# Altium schematic sheet gsm.SchDoc
size B; SheetNumber: 5; SheetTotal: 6
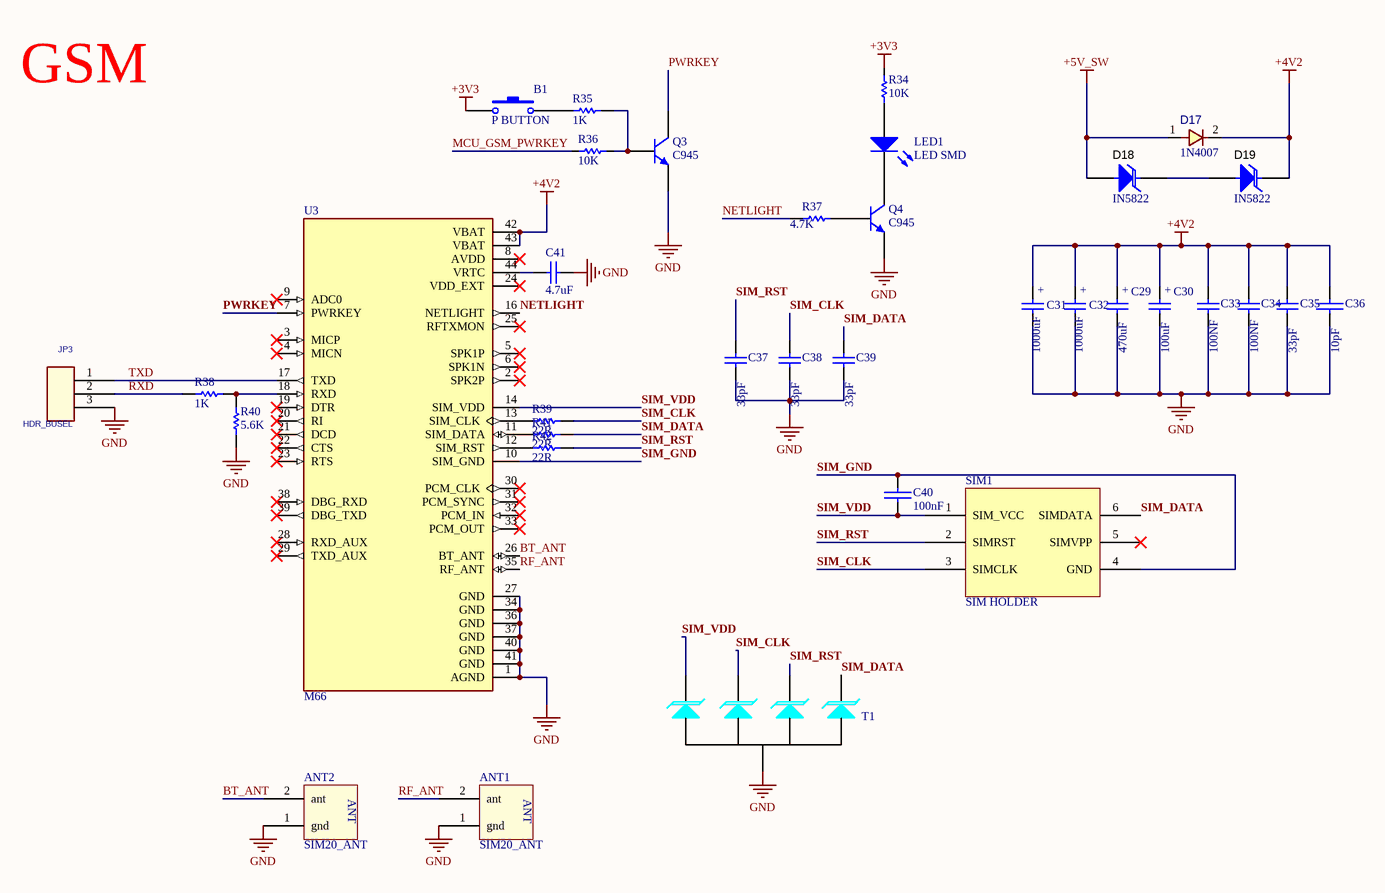
[diagram p0: gsm.SchDoc]

## Parts
ANT1  SIM20_ANT  [MY_SIM20_ANT]
ANT2  SIM20_ANT  [MY_SIM20_ANT]
B1  P BUTTON  [MY_SPST-0.5]
C29  470uF  [MY_Cap1000u -smd]
C30  100uF  [MY_Cap1000u -smd]
C31  1000uF  [MY_CAP_SMD-C]
C32  1000uF  [MY_CAP_SMD-C]
C33  100NF  [CAP0603]
C34  100NF  [CAP0603]
C35  33pF  [CAP0603]
C36  10pF  [Cap-0603]
C37  33pF  [CAP0603]
C38  33pF  [CAP0603]
C39  33pF  [CAP0603]
C40  100nF  [Cap-0805]
C41  4.7uF  [CAPC3413X12N]
D17  value 1N4007  [D_SMA]  (hidden comment: 1N4007 SMD M7)
D18  value IN5822  [BYW98]  (hidden comment: IN5822 THD)
D19  value IN5822  [BYW98]  (hidden comment: IN5822 THD)
JP3  HDR_BUSEL  [HDR_1x3]
LED1  LED SMD  [MY_LED_SMD]
Q3  C945  [SOT23_N]
Q4  C945  [SOT23_N]
R34  10K  [RES 0603 (1608X06L)]
R35  1K  [Resistor_SMD_1206 (3216)]
R36  10K  [RES 0603 (1608X06L)]
R37  4.7K  [Resistor_SMD_1206]
R38  1K  [Resistor_SMD_1206 (3216)]
R39  22R  [Resistor_SMD_0603 (1608)]
R40  5.6K  [Resistor_SMD_0805 (2012)]
R41  22R  [Resistor_SMD_0603 (1608)]
R42  22R  [Resistor_SMD_0603 (1608)]
SIM1  SIM HOLDER  [SIM HOLDER 6]
T1  TVS (SMF05)  [SC70-5L]  (value not drawn)
U3  M66  [XCVR_M66]

## Nets
+3V3: B1.1 R34.2
+4V2: C29.+ C30.+ C31.+ C32.+ C33.2 C34.2 C35.2 C36.1 D17.2 D19.2(K) U3.42(VBAT) U3.43(VBAT)
+5V_SW: D17.1 D18.1(A)
GND: ANT1.1(gnd) ANT2.1(gnd) C29.- C30.- C31.- C32.- C33.1 C34.1 C35.1 C36.2 C37.1 C38.1 C39.1 C41.2 JP3.3 Q3.2(E) Q4.2(E) R40.1 T1.2(A) U3.1(AGND) U3.27(GND) U3.34(GND) U3.36(GND) U3.37(GND) U3.40(GND) U3.41(GND)
BT_ANT: ANT2.2(ant) U3.26(BT_ANT)
MCU_GSM_PWRKEY: R36.1
NETLIGHT: R37.1 U3.16(NETLIGHT)
PWRKEY: Q3.3(C) U3.7(PWRKEY)
RF_ANT: ANT1.2(ant) U3.35(RF_ANT)
RXD: JP3.2 R38.1
SIM_CLK: C38.2 R39.2 SIM1.3(SIMCLK) T1.3(K)
SIM_DATA: C39.2 R41.2 SIM1.6(SIMDATA) T1.5(K)
SIM_GND: C40.1 SIM1.4(GND) U3.10(SIM_GND)
SIM_RST: C37.2 R42.2 SIM1.2(SIMRST) T1.4(K)
SIM_VDD: C40.2 SIM1.1(SIM_VCC) T1.1(K) U3.14(SIM_VDD)
TXD: JP3.1 U3.17(TXD)
NetB1_2: B1.2 R35.1
NetC41_1: C41.1 U3.44(VRTC)
NetD18_2: D18.2(K) D19.1(A)
NetLED1_1: LED1.1(A) R34.1
NetLED1_2: LED1.2(K) Q4.3(C)
NetQ3_1: Q3.1(B) R35.2 R36.2
NetQ4_1: Q4.1(B) R37.2
NetR38_2: R38.2 R40.2 U3.18(RXD)
NetR39_1: R39.1 U3.13(SIM_CLK)
NetR41_1: R41.1 U3.11(SIM_DATA)
NetR42_1: R42.1 U3.12(SIM_RST)

Not connected (* = marked no-connect by the designer): SIM1 5(SIMVPP)*; U3 2(SPK2P)* 3(MICP)* 4(MICN)* 5(SPK1P)* 6(SPK1N)* 8(AVDD)* 9(ADC0)* 19(DTR)* 20(RI)* 21(DCD)* 22(CTS)* 23(RTS)* 24(VDD_EXT)* 25(RFTXMON)* 28(RXD_AUX)* 29(TXD_AUX)* 30(PCM_CLK)* 31(PCM_SYNC)* 32(PCM_IN)* 33(PCM_OUT)* 38(DBG_RXD)* 39(DBG_TXD)*

## Notes on the sheet
- GSM

## Library data of the parts
ANT1 ANT2 = SIM20_ANT: ANT
B1 = PUSH BUTTON_SMALL
C29 C30 = cap_smd_1000u_smd G: aluminium
C31 C32 = CAP_TANTAL_C: 6X3.2MM; Value: 3300u
C33 C34 = CAP SMD PACKAGE: TOTAL CAPACITOR SMD PACK; Designer: Abbas Basereh; Desc.: CAP SMD TOTAL PACKAGES; Data: 2017-3-10; VALUE: 100nF
C35 C37-C39 = CAP SMD PACKAGE: TOTAL CAPACITOR SMD PACK; Designer: Abbas Basereh; Desc.: CAP SMD TOTAL PACKAGES; VALUE: 100nF; Data: 2017-3-10
C36 = Capacitor.: Capacitor; Value: 100nF; LatestRevisionDate: 17-Jul-2002; LatestRevisionNote: Re-released for DXP Platform.; Publisher: Altium Limited
C40 = Capacitor.: Capacitor; LatestRevisionDate: 17-Jul-2002; LatestRevisionNote: Re-released for DXP Platform.; Publisher: Altium Limited; Value: 100nF
C41 = CAP SMD 0805: CAP 0805; Designer: Abbas Basereh; Desc.: CAP SMD 0805; Data: 16-12-2016
D17 = 1N4007 SMD M7: DIODE, GENERAL PURPOSE, 1000V/1A; DatasheetVersion: 2021; ComponentLink1Description: Website Smart World; ComponentLink1URL: https://www.smartw.ir/; ComponentLink2Description: Telegram; ComponentLink2URL: https://t.me/altium_smartw; ComponentLink3Description: Instagram; ComponentLink3URL: https://Instagram.com/smartgw.ir
D18 D19 = IN5822 THD: Diode, , 20 - 40V, 3.0 A; DatasheetVersion: 2022; ComponentLink1Description: Tarahiboard; ComponentLink1URL: https://www.tarahiboard.com/product/library-pack
JP3 = Header 1x3: header or jumper box
Q3 Q4 = C945: NPN Silicon Epitaxial Planar Transistor; Published: 2017-2-8; LatestRevisionDate: 2017; LatestRevisionNote: IPC-7351 Footprint Added.; DatasheetVersion: 2017; PackageVersion: 2017-2-8; PackageReference: SOT23; Publisher: Abbas Basereh; PackageDescription: 3-Pin SOT-23 Package 0.95 mm Pitch, 2.3 mm Lead Span; ComponentLink1Description: Manufacturer Link; ComponentLink1URL: http://www.taitroncomponents.com/; ComponentLink2Description: Datasheet; ComponentLink2URL: http://www.taitroncomponents.com/
R34 R36 = Resistor: Tolerance: 5%; Power: 1/4 W; Value: 10K
R35 R38 = Resistor: Email: razi.vesali@gmail.com; Published: 17-Jun-2016; LatestRevisionNote: Re-released for puplic; Publisher: Seyed Razi Vesali; Value: 1K
R37 = Resistor: Resistor 0.25w; Value: 1K; LatestRevisionDate: 17-Jul-2002; LatestRevisionNote: Re-released for DXP Platform.; Publisher: Altium Limited
R39-R42 = Resistor: Email: razi.vesali@gmail.com; Value: 1K; Published: 17-Jun-2016; LatestRevisionNote: Re-released for puplic; Publisher: Seyed Razi Vesali
SIM1 = SIM HOLDER: Deigner: Ali Hafizi
T1 = TVS (SMF05): SMF05 and SMF12  TVS Diode Array  For ESD and Latch-Up Protection
U3 = M66: M66 is an ultra-small quad-band GSM/GPRS module using LCC castellation packaging on the market. Based on the latest 2G chipset, it has the optimal performance in SMS & Data transmission and audio service even in harsh environment.; MF: Quectel; Availability: In Stock; Value: *; Price: None; Check_prices: https://www.snapeda.com/parts/M66/Quectel/view-part/?ref=eda; SnapEDA_Link: https://www.snapeda.com/parts/M66/Quectel/view-part/?ref=snap; MP: M66; Package: SMD-52 Quectel